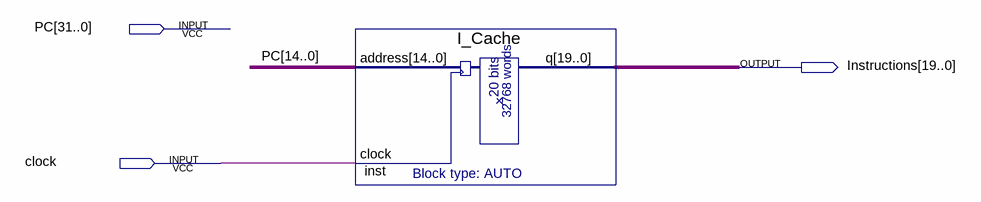
[diagram p0: schematic sheet]
// Quartus schematic Instruction_Cache.bdf as structural Verilog: 1 symbols, 3 pins
module Instruction_Cache (
  input  [31:0] PC,
  input  clock,
  output [19:0] Instructions
);

  I_Cache inst (.address(PC[14:0]), .clock(clock), .q(Instructions));
endmodule
